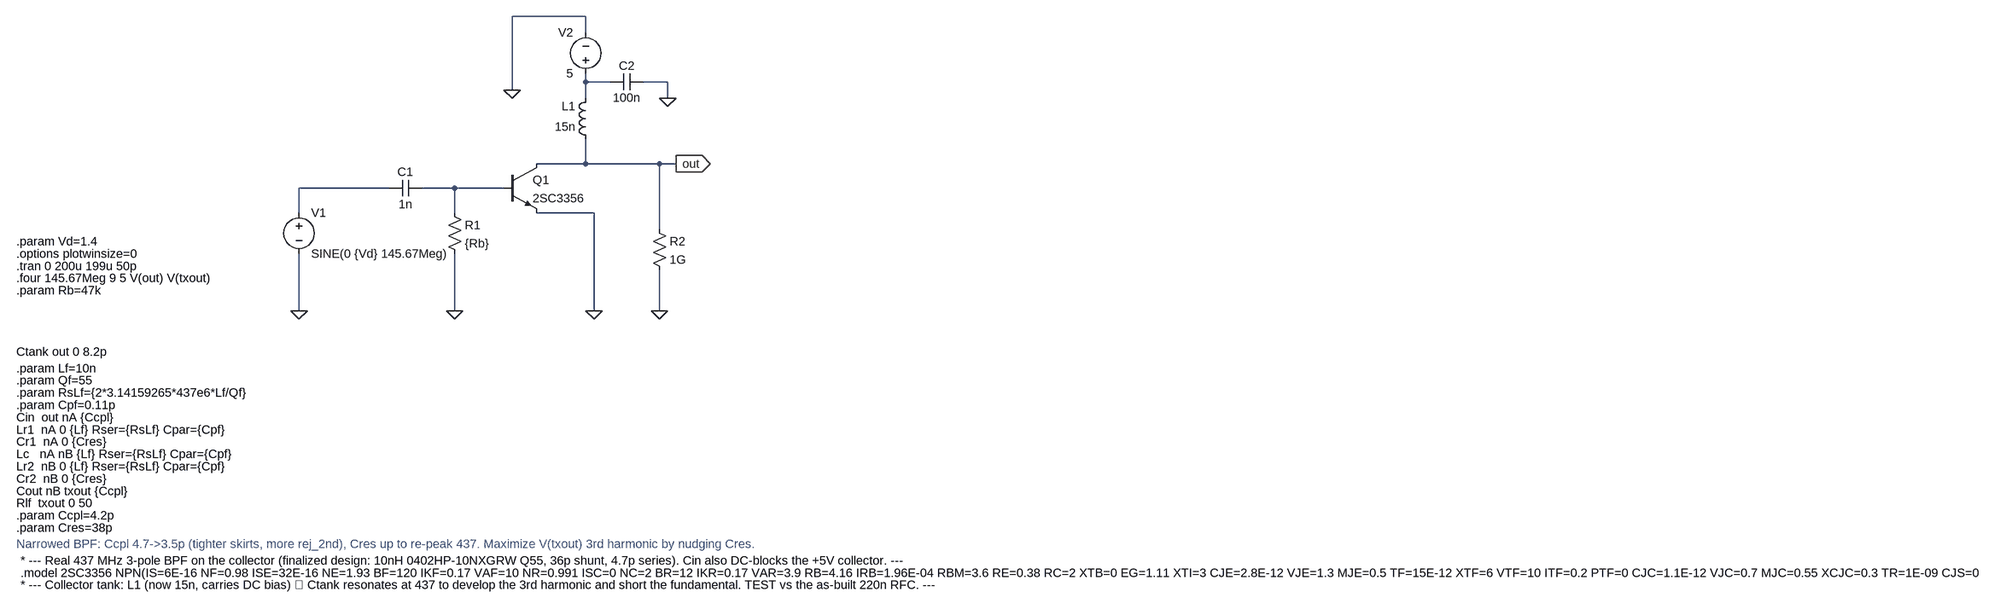
[diagram p0: schematic tripler.asc]
tripler.asc, the LTspice schematic file:
Version 4.1
SHEET 1 3716 888
WIRE 448 -240 304 -240
WIRE 448 -208 448 -240
WIRE 448 -112 448 -128
WIRE 496 -112 448 -112
WIRE 608 -112 560 -112
WIRE 304 -96 304 -240
WIRE 448 -80 448 -112
WIRE 608 -80 608 -112
WIRE 448 48 448 0
WIRE 448 48 352 48
WIRE 592 48 448 48
WIRE 624 48 592 48
WIRE 64 96 -112 96
WIRE 192 96 128 96
WIRE 288 96 192 96
WIRE -112 144 -112 96
WIRE 192 144 192 96
WIRE 464 144 352 144
WIRE 592 176 592 48
WIRE -112 336 -112 224
WIRE 192 336 192 224
WIRE 464 336 464 144
WIRE 592 336 592 256
FLAG 192 336 0
FLAG -112 336 0
FLAG 464 336 0
FLAG 304 -96 0
FLAG 608 -80 0
FLAG 592 336 0
FLAG 624 48 out
IOPIN 624 48 Out
SYMBOL voltage -112 128 R0
WINDOW 123 0 0 Left 0
WINDOW 39 0 0 Left 0
SYMATTR InstName V1
SYMATTR Value SINE(0 {Vd} 145.67Meg)
SYMBOL npn 288 48 R0
SYMATTR InstName Q1
SYMATTR Value 2SC3356
SYMBOL cap 128 80 R90
WINDOW 0 0 32 VBottom 2
WINDOW 3 32 32 VTop 2
SYMATTR InstName C1
SYMATTR Value 1n
SYMBOL cap 560 -128 R90
WINDOW 0 0 32 VBottom 2
WINDOW 3 32 32 VTop 2
SYMATTR InstName C2
SYMATTR Value 100n
SYMBOL ind 464 16 R180
WINDOW 0 36 80 Left 2
WINDOW 3 36 40 Left 2
SYMATTR InstName L1
SYMATTR Value 15n
SYMATTR SpiceLine Rser=0.3
SYMBOL res 176 128 R0
SYMATTR InstName R1
SYMATTR Value {Rb}
SYMBOL res 576 160 R0
SYMATTR InstName R2
SYMATTR Value 1G
SYMBOL voltage 448 -112 R180
WINDOW 0 24 96 Left 2
WINDOW 3 24 16 Left 2
WINDOW 123 0 0 Left 0
WINDOW 39 0 0 Left 0
SYMATTR InstName V2
SYMATTR Value 5
TEXT -664 248 Left 2 !.tran 0 200u 199u 50p
TEXT -664 224 Left 2 !.options plotwinsize=0
TEXT -664 272 Left 2 !.four 145.67Meg 9 5 V(out) V(txout)
TEXT -664 200 Left 2 !.param Vd=1.4
TEXT -664 296 Left 2 !.param Rb=47k
TEXT -656 848 Left 2 !.model 2SC3356 NPN(IS=6E-16 NF=0.98 ISE=32E-16 NE=1.93 BF=120 IKF=0.17 VAF=10 NR=0.991 ISC=0 NC=2 BR=12 IKR=0.17 VAR=3.9 RB=4.16 IRB=1.96E-04 RBM=3.6 RE=0.38 RC=2 XTB=0 EG=1.11 XTI=3 CJE=2.8E-12 VJE=1.3 MJE=0.5 TF=15E-12 XTF=6 VTF=10 ITF=0.2 PTF=0 CJC=1.1E-12 VJC=0.7 MJC=0.55 XCJC=0.3 TR=1E-09 CJS=0 VJS=0.75 MJS=0 FC=0.5)
TEXT -656 872 Left 2 !* --- Collector tank: L1 (now 15n, carries DC bias) ∥ Ctank resonates at 437 to develop the 3rd harmonic and short the fundamental. TEST vs the as-built 220n RFC. ---
TEXT -664 416 Left 2 !Ctank out 0 8.2p
TEXT -656 824 Left 2 !* --- Real 437 MHz 3-pole BPF on the collector (finalized design: 10nH 0402HP-10NXGRW Q55, 36p shunt, 4.7p series). Cin also DC-blocks the +5V collector. ---
TEXT -664 448 Left 2 !.param Lf=10n
TEXT -664 472 Left 2 !.param Qf=55
TEXT -664 496 Left 2 !.param RsLf={2*3.14159265*437e6*Lf/Qf}
TEXT -664 520 Left 2 !.param Cpf=0.11p
TEXT -664 544 Left 2 !Cin  out nA {Ccpl}
TEXT -664 568 Left 2 !Lr1  nA 0 {Lf} Rser={RsLf} Cpar={Cpf}
TEXT -664 592 Left 2 !Cr1  nA 0 {Cres}
TEXT -664 616 Left 2 !Lc   nA nB {Lf} Rser={RsLf} Cpar={Cpf}
TEXT -664 640 Left 2 !Lr2  nB 0 {Lf} Rser={RsLf} Cpar={Cpf}
TEXT -664 664 Left 2 !Cr2  nB 0 {Cres}
TEXT -664 688 Left 2 !Cout nB txout {Ccpl}
TEXT -664 712 Left 2 !Rlf  txout 0 50
TEXT -664 736 Left 2 !.param Ccpl=4.2p
TEXT -664 760 Left 2 !.param Cres=38p
TEXT -664 792 Left 2 ;Narrowed BPF: Ccpl 4.7->3.5p (tighter skirts, more rej_2nd), Cres up to re-peak 437. Maximize V(txout) 3rd harmonic by nudging Cres.

The netlist it stands for:
* tripler.asc
V1 N002 0 SINE(0 {Vd} 145.67Meg)
Q1 out N003 0 0 2SC3356
C1 N003 N002 1n
C2 0 N001 100n
L1 out N001 15n Rser=0.3
R1 N003 0 {Rb}
R2 out 0 1G
V2 N001 0 5
.model NPN NPN
.model PNP PNP
.lib standard.bjt
.tran 0 200u 199u 50p
.options plotwinsize=0
.four 145.67Meg 9 5 V(out) V(txout)
.param Vd=1.4
.param Rb=47k
.model 2SC3356 NPN(IS=6E-16 NF=0.98 ISE=32E-16 NE=1.93 BF=120 IKF=0.17 VAF=10 NR=0.991 ISC=0 NC=2 BR=12 IKR=0.17 VAR=3.9 RB=4.16 IRB=1.96E-04 RBM=3.6 RE=0.38 RC=2 XTB=0 EG=1.11 XTI=3 CJE=2.8E-12 VJE=1.3 MJE=0.5 TF=15E-12 XTF=6 VTF=10 ITF=0.2 PTF=0 CJC=1.1E-12 VJC=0.7 MJC=0.55 XCJC=0.3 TR=1E-09 CJS=0 VJS=0.75 MJS=0 FC=0.5)
* --- Collector tank: L1 (now 15n, carries DC bias) ∥ Ctank resonates at 437 to develop the 3rd harmonic and short the fundamental. TEST vs the as-built 220n RFC. ---
Ctank out 0 8.2p
* --- Real 437 MHz 3-pole BPF on the collector (finalized design: 10nH 0402HP-10NXGRW Q55, 36p shunt, 4.7p series). Cin also DC-blocks the +5V collector. ---
.param Lf=10n
.param Qf=55
.param RsLf={2*3.14159265*437e6*Lf/Qf}
.param Cpf=0.11p
Cin  out nA {Ccpl}
Lr1  nA 0 {Lf} Rser={RsLf} Cpar={Cpf}
Cr1  nA 0 {Cres}
Lc   nA nB {Lf} Rser={RsLf} Cpar={Cpf}
Lr2  nB 0 {Lf} Rser={RsLf} Cpar={Cpf}
Cr2  nB 0 {Cres}
Cout nB txout {Ccpl}
Rlf  txout 0 50
.param Ccpl=4.2p
.param Cres=38p
* Narrowed BPF: Ccpl 4.7->3.5p (tighter skirts, more rej_2nd), Cres up to re-peak 437. Maximize V(txout) 3rd harmonic by nudging Cres.
.backanno
.end